# Altium schematic sheet PD_v5.SchDoc
size A4; SheetNumber: 1; SheetTotal: 2
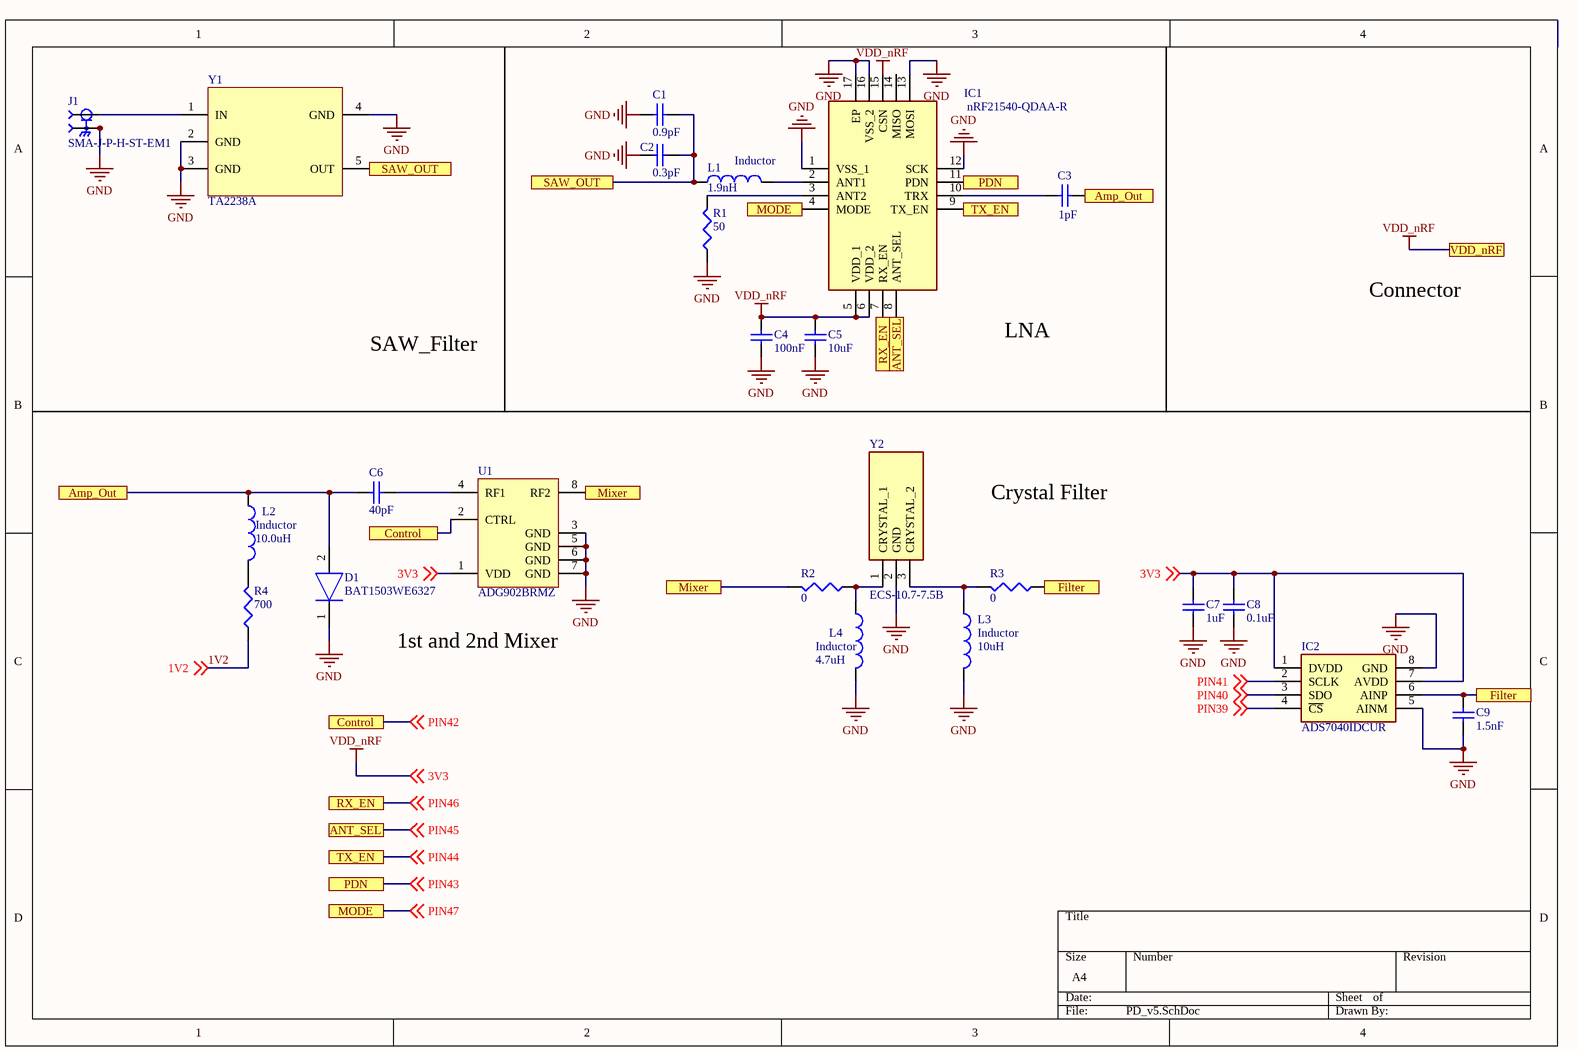
[diagram p0: PD_v5.SchDoc]

## Parts
C1  value 0.9pF  [CAPC0603X33N]  (hidden comment: 陶瓷电容)
C2  value 0.3pF  [CAPC0603X33N]  (hidden comment: 陶瓷电容)
C3  value 1pF  [CAPC0603X33N]  (hidden comment: 陶瓷电容)
C4  value 100nF  [CAPC0603X33N]  (hidden comment: 陶瓷电容)
C5  value 10uF  [1608[0603]]  (hidden comment: 陶瓷电容)
C6  value 40pF  [CAPC0603X33N]  (hidden comment: 陶瓷电容)
C7  value 1uF  [1608[0603]]  (hidden comment: 陶瓷电容)
C8  value 0.1uF  [1608[0603]]  (hidden comment: 陶瓷电容)
C9  value 1.5nF  [1608[0603]]  (hidden comment: 陶瓷电容)
D1  BAT1503WE6327  [SOD2513X110N]
IC1  nRF21540-QDAA-R  [QFN65P400X400X90-17N-D]
IC2  ADS7040IDCUR  [SOP50P310X90-8N]
J1  SMA-J-P-H-ST-EM1  [SAMTEC_SMA-J-P-H-ST-EM1]
L1  Inductor  value 1.9nH  [CAPC0603X33N]
L2  Inductor  value 10.0uH  [1608[0603]]
L3  Inductor  value 10uH  [6-0805_N]
L4  Inductor  value 4.7uH  [6-0805_N]
R1  value 50  [CAPC0603X33N]  (hidden comment: 电阻)
R2  value 0  [1608[0603]]  (hidden comment: 电阻)
R3  value 0  [1608[0603]]  (hidden comment: 电阻)
R4  value 700  [1608[0603]]  (hidden comment: 电阻)
U1  ADG902BRMZ  [SOP65P490X110-8N]
Y1  TA2238A  [TA2238A]
Y2  ECS-10.7-7.5B  [ECS10775A]

## Ports
Amp_Out, ANT_SEL, Control, Filter, Mixer, MODE, PDN, RX_EN, SAW_OUT, TX_EN, VDD_nRF

## Nets
GND: C1.1 C2.1 C4.1 C5.2 C7.2 C8.2 C9.2 D1.1(K) IC1.1(VSS_1) IC1.12(SCK) IC1.13(MOSI) IC1.16(VSS_2) IC1.17(EP) IC2.5(AINM) IC2.8(GND) J1.2_1 J1.2_2 J1.3_1 J1.3_2 L3.2 L4.2 R1.1 U1.3(GND) U1.5(GND) U1.6(GND) U1.7(GND) Y1.2(GND) Y1.3(GND) Y1.4(GND) Y2.2(GND)
VDD_nRF: C4.2 C5.1 C7.1 C8.1 IC1.5(VDD_1) IC1.6(VDD_2) IC1.15(CSN) IC2.1(DVDD) IC2.7(AVDD) U1.1(VDD) ; off-sheet 3V3, port VDD_nRF  [also labelled 3V3]
1V2: R4.1 ; off-sheet 1V2
Amp_Out: C3.2 C6.1 D1.2(A) L2.1 ; port Amp_Out
Filter: C9.1 IC2.6(AINP) R3.1 ; port Filter
Mixer: R2.2 U1.8(RF2) ; port Mixer
PIN39: IC2.4(~{CS}) ; off-sheet PIN39
PIN40: IC2.3(SDO) ; off-sheet PIN40
PIN41: IC2.2(SCLK) ; off-sheet PIN41
PIN42: U1.2(CTRL) ; off-sheet PIN42, port Control
PIN43: IC1.11(PDN) ; off-sheet PIN43, port PDN
PIN44: IC1.9(TX_EN) ; off-sheet PIN44, port TX_EN
PIN45: IC1.8(ANT_SEL) ; off-sheet PIN45, port ANT_SEL
PIN46: IC1.7(RX_EN) ; off-sheet PIN46, port RX_EN
PIN47: IC1.4(MODE) ; off-sheet PIN47, port MODE
SAW_OUT: C1.2 C2.2 L1.1 Y1.5(OUT) ; port SAW_OUT
NetC3_1: C3.1 IC1.10(TRX)
NetC6_2: C6.2 U1.4(RF1)
NetIC1_2: IC1.2(ANT1) L1.2
NetIC1_3: IC1.3(ANT2) R1.2
NetJ1_1: J1.1 Y1.1(IN)
NetL2_2: L2.2 R4.2
NetL3_1: L3.1 R3.2 Y2.3(CRYSTAL_2)
NetL4_1: L4.1 R2.1 Y2.1(CRYSTAL_1)

Not connected (* = marked no-connect by the designer): IC1 14(MISO)

## Notes on the sheet
- Connector
- SAW_Filter
- LNA
- Crystal Filter
- 1st and 2nd Mixer

## Library data of the parts
C1-C9 = 陶瓷电容: Capacitor (Semiconductor SIM Model); Published: 8-Jun-2000; LatestRevisionDate: 29-May-2009; LatestRevisionNote: IPC-7351 Footprint Added.; PackageReference: C1206; Publisher: Altium Limited; PackageDescription: Chip Capacitor
D1 = BAT1503WE6327: Diode; Manufacturer_Name: Infineon; Datasheet Link: http://uk.rs-online.com/web/p/products/6532351; Height: 1.1mm; Manufacturer_Part_Number: BAT1503WE6327
IC1 = nRF21540-QDAA-R: Integrated Circuit; Manufacturer_Name: Nordic Semiconductor; Datasheet Link: https://www.mouser.com/datasheet/2/297/nRF21540_OPS_v0.5.2-1699339.pdf; Height: 0.9mm; Manufacturer_Part_Number: nRF21540-QDAA-R; Mouser Part Number: 949-NRF21540-QDAA-R; Mouser Price/Stock: https://www.mouser.co.uk/ProductDetail/Nordic-Semiconductor/nRF21540-QDAA-R?qs=xZ%2FP%252Ba9zWqaQBa1ysoqtQg%3D%3D
IC2 = ADS7040IDCUR: Integrated Circuit; Manufacturer_Name: Texas Instruments; Datasheet Link: http://www.ti.com/lit/gpn/ads7040; Height: 0.9mm; Manufacturer_Part_Number: ADS7040IDCUR; Mouser Part Number: 595-ADS7040IDCUR; Mouser Price/Stock: https://www.mouser.co.uk/ProductDetail/Texas-Instruments/ADS7040IDCUR?qs=pqSajtDZXRUnGgXj5Qrp4Q%3D%3D; Arrow Part Number: ADS7040IDCUR; Arrow Price/Stock: https://www.arrow.com/en/products/ads7040idcur/texas-instruments
J1 = SMA-J-P-H-ST-EM1: SMA Connector Jack, Female Socket 50Ohm Board Edge, End Launch Solder; MF: Samtec; SnapEDA_Link: https://www.snapeda.com/parts/SMA-J-P-H-ST-EM1/Samtec%20Inc./view-part/134500/?ref=snap; MP: SMA-J-P-H-ST-EM1; Toby_UK-Purchase-URL: https://snapeda.com/shop?store=Toby+UK&id=134500; Value: *; Package: None; Digi-Key_Part_Number: SAM8857-ND
L1-L4 = Inductor: Code_IEC: 1005; Published: 8-Jun-2000; LatestRevisionDate: 29-May-2009; LatestRevisionNote: IPC-7351 Footprint Added.; PackageReference: 0402-A; Publisher: Altium Limited; PackageDescription: Chip Inductor; Code_JEITA: 0402
R1-R4 = 电阻: Resistor; Published: 8-Jun-2000; LatestRevisionDate: 29-May-2009; LatestRevisionNote: IPC-7351 Footprint Added.; PackageReference: J1-0603; Publisher: Altium Limited; PackageDescription: Chip Resistor
U1 = ADG901BRMZ: RF Switch, Wideband, 40 dB Isolation at 1 GHz, CMOS 1.65 V to 2.75 V, SPST Switches, RM-8, Pb-Free, 50 Tube; Configuration: SPST/NO; # Sw Functions: 1; Supply Voltage: Single (+1.65V to +2.75V); Insertion Loss (dB): 800mdB; Bandwidth: 4.5GHz; P-1dB (dBm): 17; Off Isolation: 37dB; Off Isolation Test Freq: 1G; DatasheetVersion: RevB; PackageVersion: Aug-2005; PackageReference: RM-8; PackageDescription: 8-Lead Mini Small Outline Package [MSOP]; Code_JEDEC: MO-187-AA; ComponentLink1Description: Manufacturer URL; ComponentLink1URL: www.analog.com; ComponentLink2Description: Datasheet; ComponentLink2URL: http://www.analog.com/static/imported-files/data_sheets/ADG901_902.pdf; ComponentLink3Description: Package Specification; ComponentLink3URL: http://www.analog.com/static/imported-files/packages/PKG_PDF/MSOP%28RM%29/RM_8.pdf
Y2 = ECS-10.7-7.5A: Crystal or Oscillator; Manufacturer_Name: ECS; Datasheet Link: http://www.ecsxtal.com/store/pdf/mono crystal filters.pdf; Height: 11.2mm; Manufacturer_Part_Number: ECS-10.7-7.5A; Mouser Part Number: 520-107-7.5A; Mouser Price/Stock: https://www.mouser.co.uk/ProductDetail/ECS/ECS-107-75A?qs=A5Qiz0JZgg4zSHI1UHphaA%3D%3D; Arrow Part Number: ECS-10.7-7.5A; Arrow Price/Stock: https://www.arrow.com/en/products/ecs-10.7-7.5a/ecs-international